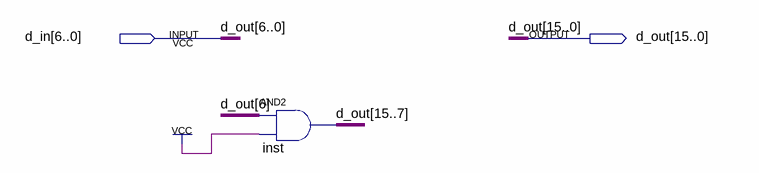
[diagram p0: schematic sheet]
// Quartus schematic sign_ext_7_16.bdf as structural Verilog: 1 symbols, 2 pins
module sign_ext_7_16 (
  input  [6:0] d_in,
  output [15:0] d_out
);

  assign d_out[15:7] = {9{d_in[6]}} & {9{1'b1}};  // AND2 inst, 9 bits wide

  assign d_out[6:0] = d_in;
endmodule
